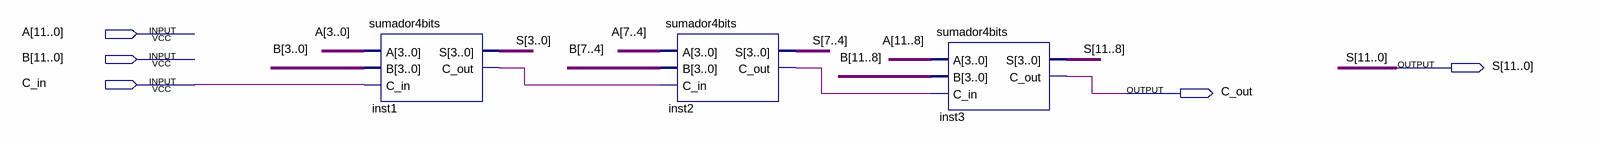
[diagram p0: schematic sheet]
// Quartus schematic sumador12bits.bdf as structural Verilog: 3 symbols, 5 pins
module sumador12bits (
  input  [11:0] A,
  input  [11:0] B,
  input  C_in,
  output [11:0] S,
  output C_out
);

  wire inst1_c_out, inst2_c_out;

  sumador4bits inst1 (.A(A[3:0]), .B(B[3:0]), .C_in(C_in), .S(S[3:0]), .C_out(inst1_c_out));
  sumador4bits inst2 (.A(A[7:4]), .B(B[7:4]), .C_in(inst1_c_out), .S(S[7:4]), .C_out(inst2_c_out));
  sumador4bits inst3 (.A(A[11:8]), .B(B[11:8]), .C_in(inst2_c_out), .S(S[11:8]), .C_out(C_out));
endmodule
